# Altium schematic sheet Sheet2.SchDoc
size A4; Organization: Altium Limited; Address1: L3, 12a Rodborough Rd; Address2: Frenchs Forest; Address3: NSW; Address4: Australia 2086
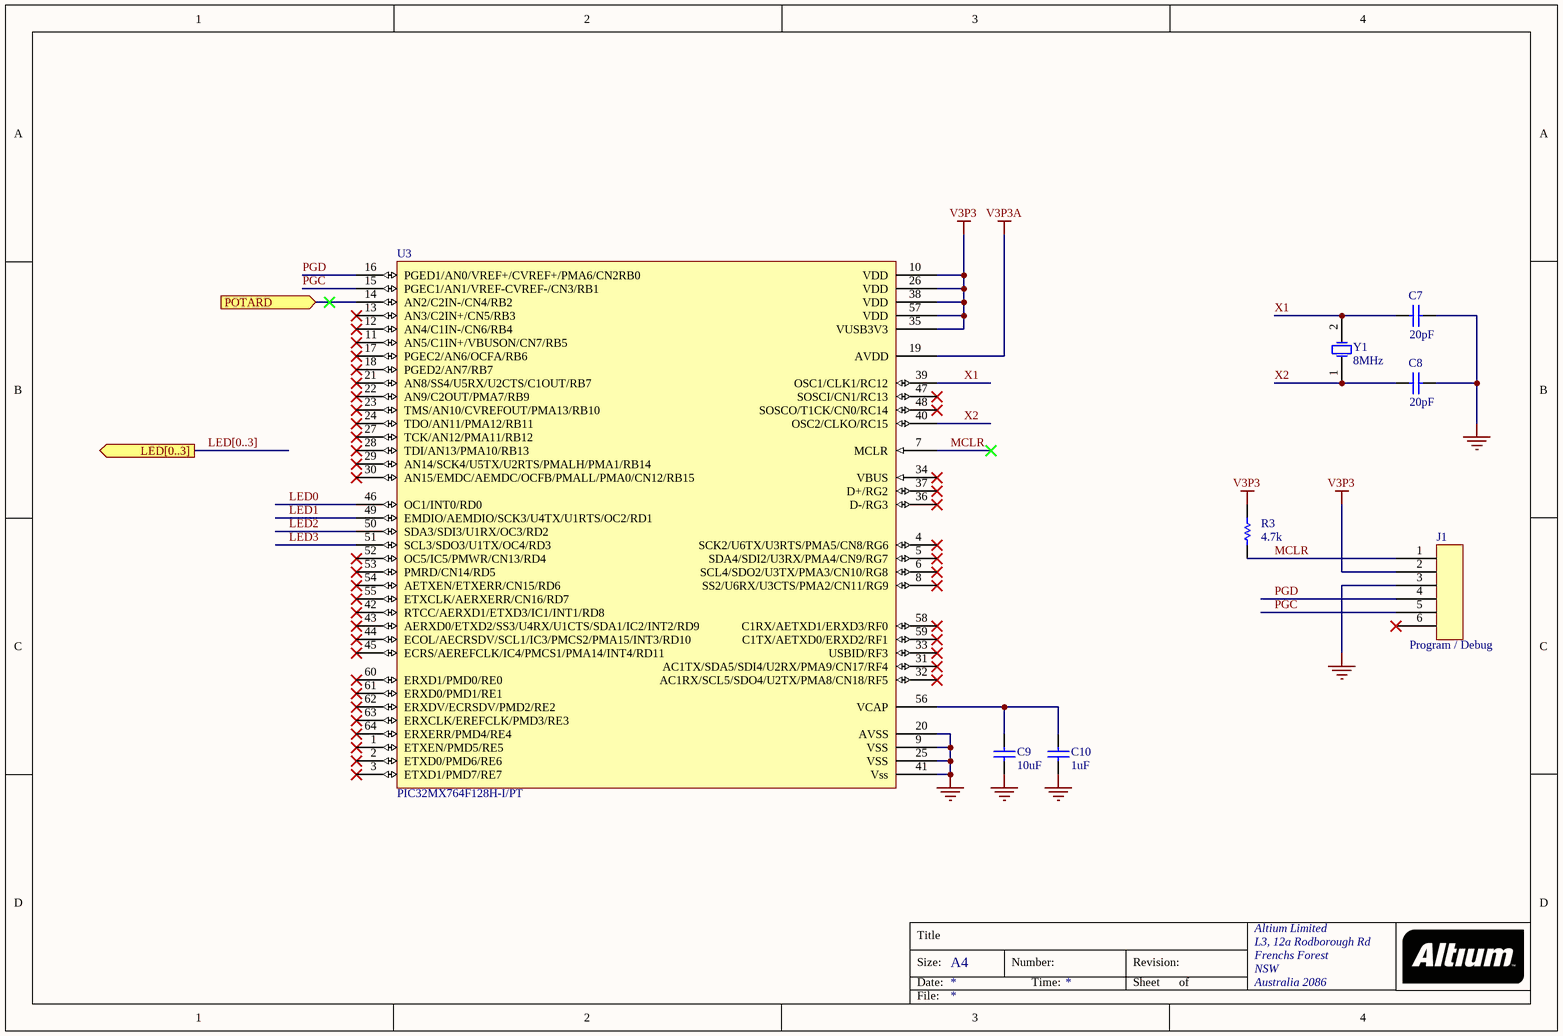
[diagram p0: Sheet2.SchDoc]

## Parts
C7  value 20pF  [RAD-0.3]  (hidden comment: Cap)
C8  value 20pF  [RAD-0.3]  (hidden comment: Cap)
C9  value 10uF  [RAD-0.3]  (hidden comment: Cap)
C10  value 1uF  [RAD-0.3]  (hidden comment: Cap)
J1  Program / Debug
R3  value 4.7k  [AXIAL-0.3]  (hidden comment: Res1)
U3  PIC32MX764F128H-I/PT
Y1  8MHz  [Fox Quartz]

## Ports
LED[0..3] (out), POTARD (in)

## Nets
GND: C7.2 C8.2 C9.2 C10.2 J1.3 U3.9(VSS) U3.20(AVSS) U3.25(VSS) U3.41(Vss)
V3P3: J1.2 R3.2 U3.10(VDD) U3.26(VDD) U3.35(VUSB3V3) U3.38(VDD) U3.57(VDD)
V3P3A: U3.19(AVDD)
LED0: U3.46(OC1/INT0/RD0)
LED1: U3.49(EMDIO/AEMDIO/SCK3/U4TX/U1RTS/OC2/RD1)
LED2: U3.50(SDA3/SDI3/U1RX/OC3/RD2)
LED3: U3.51(SCL3/SDO3/U1TX/OC4/RD3)
MCLR: J1.1 R3.1 U3.7(MCLR)
PGC: J1.5 U3.15(PGEC1/AN1/VREF-CVREF-/CN3/RB1)
PGD: J1.4 U3.16(PGED1/AN0/VREF+/CVREF+/PMA6/CN2RB0)
POTARD: U3.14(AN2/C2IN-/CN4/RB2) ; port POTARD
X1: C7.1 U3.39(OSC1/CLK1/RC12) Y1.2(OSC2)
X2: C8.1 U3.40(OSC2/CLKO/RC15) Y1.1(OSC1)
NetC9_1: C9.1 C10.1 U3.56(VCAP)

Not connected (* = marked no-connect by the designer): J1 6*; U3 1(ETXEN/PMD5/RE5)* 2(ETXD0/PMD6/RE6)* 3(ETXD1/PMD7/RE7)* 4(SCK2/U6TX/U3RTS/PMA5/CN8/RG6)* 5(SDA4/SDI2/U3RX/PMA4/CN9/RG7)* 6(SCL4/SDO2/U3TX/PMA3/CN10/RG8)* 8(SS2/U6RX/U3CTS/PMA2/CN11/RG9)* 11(AN5/C1IN+/VBUSON/CN7/RB5)* 12(AN4/C1IN-/CN6/RB4)* 13(AN3/C2IN+/CN5/RB3)* 17(PGEC2/AN6/OCFA/RB6)* 18(PGED2/AN7/RB7)* 21(AN8/SS4/U5RX/U2CTS/C1OUT/RB7)* 22(AN9/C2OUT/PMA7/RB9)* 23(TMS/AN10/CVREFOUT/PMA13/RB10)* 24(TDO/AN11/PMA12/RB11)* 27(TCK/AN12/PMA11/RB12)* 28(TDI/AN13/PMA10/RB13)* 29(AN14/SCK4/U5TX/U2RTS/PMALH/PMA1/RB14)* 30(AN15/EMDC/AEMDC/OCFB/PMALL/PMA0/CN12/RB15)* 31(AC1TX/SDA5/SDI4/U2RX/PMA9/CN17/RF4)* 32(AC1RX/SCL5/SDO4/U2TX/PMA8/CN18/RF5)* 33(USBID/RF3)* 34(VBUS)* 36(D-/RG3)* 37(D+/RG2)* 42(RTCC/AERXD1/ETXD3/IC1/INT1/RD8)* 43(AERXD0/ETXD2/SS3/U4RX/U1CTS/SDA1/IC2/INT2/RD9)* 44(ECOL/AECRSDV/SCL1/IC3/PMCS2/PMA15/INT3/RD10)* 45(ECRS/AEREFCLK/IC4/PMCS1/PMA14/INT4/RD11)* 47(SOSCI/CN1/RC13)* 48(SOSCO/T1CK/CN0/RC14)* 52(OC5/IC5/PMWR/CN13/RD4)* 53(PMRD/CN14/RD5)* 54(AETXEN/ETXERR/CN15/RD6)* 55(ETXCLK/AERXERR/CN16/RD7)* 58(C1RX/AETXD1/ERXD3/RF0)* 59(C1TX/AETXD0/ERXD2/RF1)* 60(ERXD1/PMD0/RE0)* 61(ERXD0/PMD1/RE1)* 62(ERXDV/ECRSDV/PMD2/RE2)* 63(ERXCLK/EREFCLK/PMD3/RE3)* 64(ERXERR/PMD4/RE4)*

## Buses and harness runs
bus LED[0..3] = port LED[0..3]

## Notes on the sheet
- Title
- Size:
- Date:
- A4
- Number:
- Time:
- Revision:
- Sheet
- of
- File:

## Library data of the parts
C7-C10 = Cap: Capacitor; Published: 8-Jun-2000; LatestRevisionDate: 17-Jul-2002; LatestRevisionNote: Re-released for DXP Platform.; PackageReference: RAD-0.3; Publisher: Altium Limited; PackageDescription: Radial Cap, Thru-Hole; 2 Leads; 0.3 in Pin Spacing; Fabriquant: *; Fournisseur: *; Reference_fabriquant: *; Reference_fournisseur: *
J1 = Component_1
R3 = Res1: Resistor; Published: 8-Jun-2000; LatestRevisionDate: 17-Jul-2002; LatestRevisionNote: Re-released for DXP Platform.; PackageReference: AXIAL-0.3; Publisher: Altium Limited; PackageDescription: Axial Device, Thru-Hole; 2 Leads; 0.3 in Pin Spacing
U3 = PIC 32
Y1 = XTAL: Crystal Oscillator; Published: 8-Jun-2000; LatestRevisionDate: 17-Jul-2002; LatestRevisionNote: Re-released for DXP Platform.; PackageReference: R38; Publisher: Altium Limited; PackageDescription: Crystal, Thru-Hole; 2 Leads; Body 3.1 x 8.2 mm (Dia.xH)